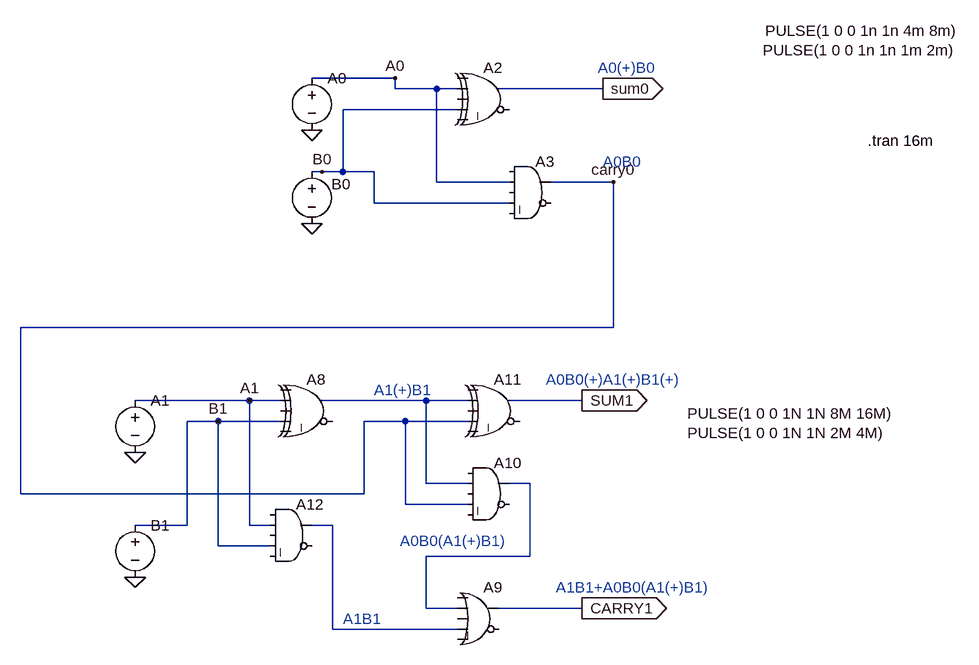
[diagram p0: schematic 2-bit half+full adder.asc]
2-bit half+full adder.asc, the LTspice schematic file:
Version 4
SHEET 1 1092 792
WIRE 208 -96 80 -96
WIRE 208 -80 208 -96
WIRE 272 -80 208 -80
WIRE 304 -80 272 -80
WIRE 528 -80 368 -80
WIRE 304 -48 128 -48
WIRE 96 48 80 48
WIRE 128 48 128 -48
WIRE 128 48 96 48
WIRE 176 48 128 48
WIRE 272 64 272 -80
WIRE 384 64 272 64
WIRE 544 64 448 64
WIRE 176 96 176 48
WIRE 384 96 176 96
WIRE 544 288 544 64
WIRE 544 288 -368 288
WIRE -16 400 -192 400
WIRE 32 400 -16 400
WIRE 256 400 96 400
WIRE 320 400 256 400
WIRE 496 400 384 400
WIRE -64 432 -112 432
WIRE 32 432 -64 432
WIRE 224 432 160 432
WIRE 320 432 224 432
WIRE 256 528 256 400
WIRE 320 528 256 528
WIRE 416 528 384 528
WIRE -368 544 -368 288
WIRE 160 544 160 432
WIRE 160 544 -368 544
WIRE 224 560 224 432
WIRE 320 560 224 560
WIRE -112 592 -112 432
WIRE -112 592 -192 592
WIRE -16 592 -16 400
WIRE 16 592 -16 592
WIRE 112 592 80 592
WIRE -64 624 -64 432
WIRE 16 624 -64 624
WIRE 416 640 416 528
WIRE 416 640 256 640
WIRE 256 720 256 640
WIRE 304 720 256 720
WIRE 496 720 368 720
WIRE 112 752 112 592
WIRE 304 752 112 752
FLAG -192 480 0
FLAG -192 672 0
FLAG 496 400 SUM1
IOPIN 496 400 Out
FLAG 496 720 CARRY1
IOPIN 496 720 Out
FLAG -16 400 A1
FLAG -64 432 B1
FLAG 80 -16 0
FLAG 80 128 0
FLAG 528 -80 sum0
IOPIN 528 -80 Out
FLAG 544 64 carry0
FLAG 208 -96 A0
FLAG 96 48 B0
SYMBOL voltage -192 384 R0
WINDOW 3 850 36 Left 2
WINDOW 123 0 0 Left 0
WINDOW 39 0 0 Left 0
SYMATTR Value PULSE(1 0 0 1N 1N 8M 16M)
SYMATTR InstName A1
SYMBOL voltage -192 576 R0
WINDOW 3 850 -126 Left 2
WINDOW 123 0 0 Left 0
WINDOW 39 0 0 Left 0
SYMATTR Value PULSE(1 0 0 1N 1N 2M 4M)
SYMATTR InstName B1
SYMBOL Digital\\xor 80 352 R0
SYMATTR InstName A8
SYMBOL Digital\\or 336 672 R0
SYMATTR InstName A9
SYMBOL Digital\\and 352 480 R0
SYMATTR InstName A10
SYMBOL Digital\\xor 368 352 R0
SYMATTR InstName A11
SYMBOL Digital\\and 48 544 R0
SYMATTR InstName A12
SYMBOL Digital\\and 416 16 R0
SYMATTR InstName A3
SYMBOL Digital\\xor 352 -128 R0
SYMATTR InstName A2
SYMBOL voltage 80 -112 R0
WINDOW 123 0 0 Left 0
WINDOW 39 0 0 Left 0
WINDOW 3 698 -57 Left 2
SYMATTR InstName A0
SYMATTR Value PULSE(1 0 0 1n 1n 4m 8m)
SYMBOL voltage 80 32 R0
WINDOW 123 0 0 Left 0
WINDOW 39 0 0 Left 0
WINDOW 0 30 35 Left 2
WINDOW 3 694 -171 Left 2
SYMATTR InstName B0
SYMATTR Value PULSE(1 0 0 1n 1n 1m 2m)
TEXT 936 0 Left 2 !.tran 16m
TEXT 520 -112 Left 2 ;A0(+)B0
TEXT 528 32 Left 2 ;A0B0
TEXT 176 384 Left 2 ;A1(+)B1
TEXT 440 368 Left 2 ;A0B0(+)A1(+)B1(+)
TEXT 128 736 Left 2 ;A1B1
TEXT 216 616 Left 2 ;A0B0(A1(+)B1)
TEXT 456 688 Left 2 ;A1B1+A0B0(A1(+)B1)

The netlist it stands for:
* 2-bit half+full adder.asc
V§A1 A1 0 PULSE(1 0 0 1N 1N 8M 16M)
V§B1 B1 0 PULSE(1 0 0 1N 1N 2M 4M)
A8 0 A1 0 B1 0 0 N001 0 XOR
A9 0 N002 0 N003 0 0 CARRY1 0 OR
A10 0 N001 0 carry0 0 0 N002 0 AND
A11 0 N001 0 carry0 0 0 SUM1 0 XOR
A12 0 A1 0 B1 0 0 N003 0 AND
A3 0 A0 0 B0 0 0 carry0 0 AND
A2 0 A0 0 B0 0 0 sum0 0 XOR
V§A0 A0 0 PULSE(1 0 0 1n 1n 4m 8m)
V§B0 B0 0 PULSE(1 0 0 1n 1n 1m 2m)
.tran 16m
* A0(+)B0
* A0B0
* A1(+)B1
* A0B0(+)A1(+)B1(+)
* A1B1
* A0B0(A1(+)B1)
* A1B1+A0B0(A1(+)B1)
.backanno
.end

* Results of the author's LTspice run, read from the files saved beside the schematic
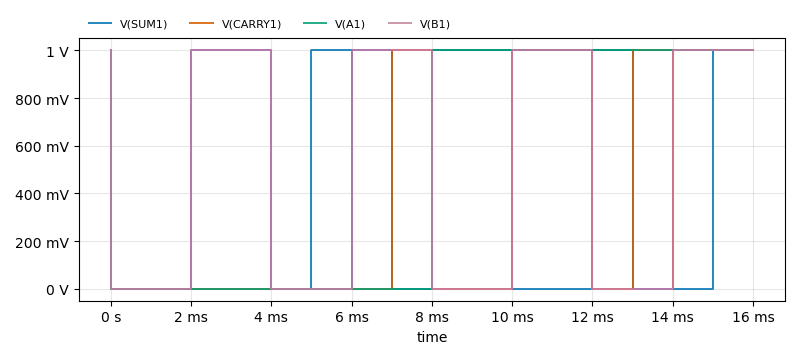
[diagram p1: Transient Analysis of 2-bit half+full adder.asc, plotted from the saved traces]
* Transient Analysis, 1 run:
*   V(SUM1): min 0 V, max 1 V, average 500 mV, rms 707.1 mV, last 1 V
*   V(CARRY1): min 0 V, max 1 V, average 375 mV, rms 612.4 mV, last 1 V
*   V(A1): min 0 V, max 1 V, average 500 mV, rms 707.1 mV, last 1 V
*   V(B1): min 0 V, max 1 V, average 500 mV, rms 707.1 mV, last 1 V